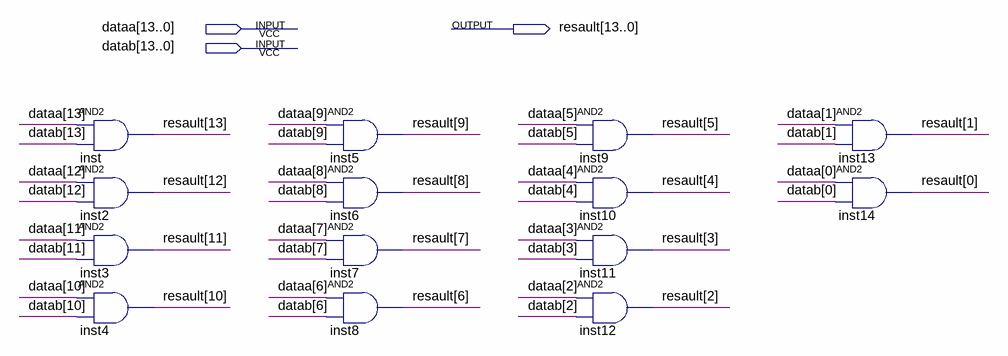
[diagram p0: schematic sheet]
// Quartus schematic ALD_AND.bdf as structural Verilog: 14 symbols, 3 pins
module ALD_AND (
  input  [13:0] dataa,
  input  [13:0] datab,
  output [13:0] resault
);

  and inst (resault[13], dataa[13], datab[13]);
  and inst2 (resault[12], dataa[12], datab[12]);
  and inst3 (resault[11], dataa[11], datab[11]);
  and inst4 (resault[10], dataa[10], datab[10]);
  and inst5 (resault[9], dataa[9], datab[9]);
  and inst6 (resault[8], dataa[8], datab[8]);
  and inst7 (resault[7], dataa[7], datab[7]);
  and inst8 (resault[6], dataa[6], datab[6]);
  and inst9 (resault[5], dataa[5], datab[5]);
  and inst10 (resault[4], dataa[4], datab[4]);
  and inst11 (resault[3], dataa[3], datab[3]);
  and inst12 (resault[2], dataa[2], datab[2]);
  and inst13 (resault[1], dataa[1], datab[1]);
  and inst14 (resault[0], dataa[0], datab[0]);
endmodule
